# Altium schematic sheet USB2RS485.SchDoc
size A4
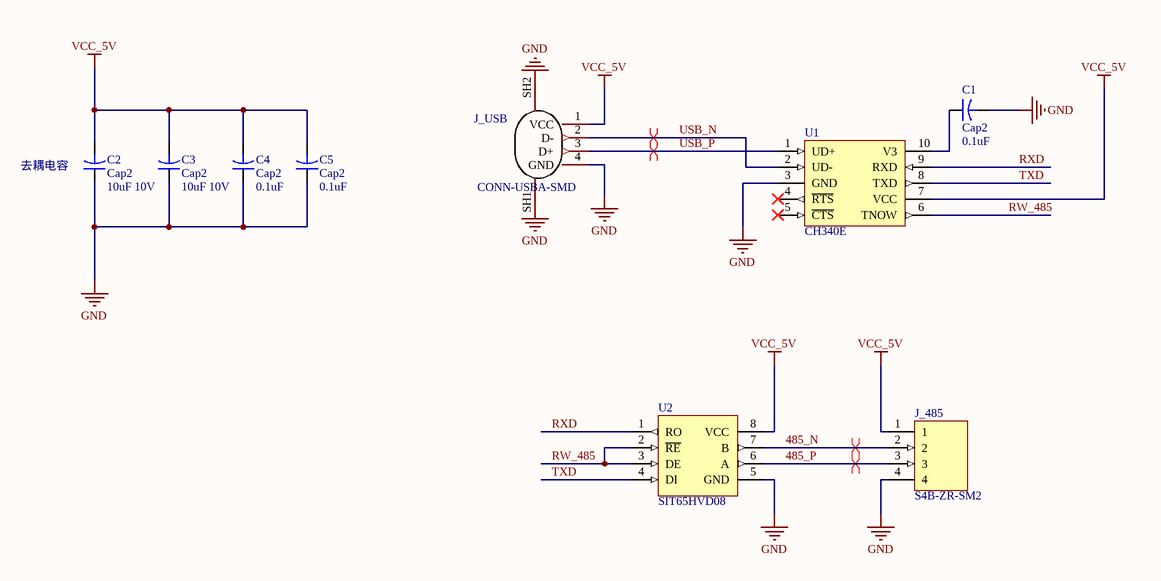
[diagram p0: USB2RS485.SchDoc]

## Parts
C1  Cap2  value 0.1uF  [CAPR5-4X5]
C2  Cap2  value 10uF 10V  [CAPR5-4X5]
C3  Cap2  value 10uF 10V  [CAPR5-4X5]
C4  Cap2  value 0.1uF  [CAPR5-4X5]
C5  Cap2  value 0.1uF  [CAPR5-4X5]
J_485  S4B-ZR-SM2  [SM2]
J_USB  CONN-USBA-SMD  [USB-A-SMD_AF]
U1  CH340E  [MSOP10]
U2  SIT65HVD08  [MSOP8]

## Nets
GND: C1.2 C2.1 C3.1 C4.1 C5.1 J_485.4 J_USB.4(GND) J_USB.SH1 J_USB.SH2 U1.3(GND) U2.5(GND)
VCC_5V: C2.2 C3.2 C4.2 C5.2 J_485.1 J_USB.1(VCC) U1.7(VCC) U2.8(VCC)
485_N: J_485.2 U2.7(B)
485_P: J_485.3 U2.6(A)
RW_485: U1.6(TNOW) U2.2(~{RE}) U2.3(DE)
RXD: U1.9(RXD) U2.1(RO)
TXD: U1.8(TXD) U2.4(DI)
USB_N: J_USB.2(D-) U1.2(UD-)
USB_P: J_USB.3(D+) U1.1(UD+)
NetC1_1: C1.1 U1.10(V3)

Not connected (* = marked no-connect by the designer): U1 4(~{RTS})* 5(~{CTS})*

## Layout directives
differential pair: 485_N, 485_P, USB_N, USB_P

## Notes on the sheet
- (near C2) 去耦电容

## Library data of the parts
C1-C5 = Cap2: Capacitor; Published: 23-Sep-2002; PackageReference: CAPR5-4X5; Publisher: Altium Limited; PackageDescription: Capacitor; 2 Leads
J_485 = CONN4B
J_USB = CONN-USB
U2 = SIT65HVD08DGK